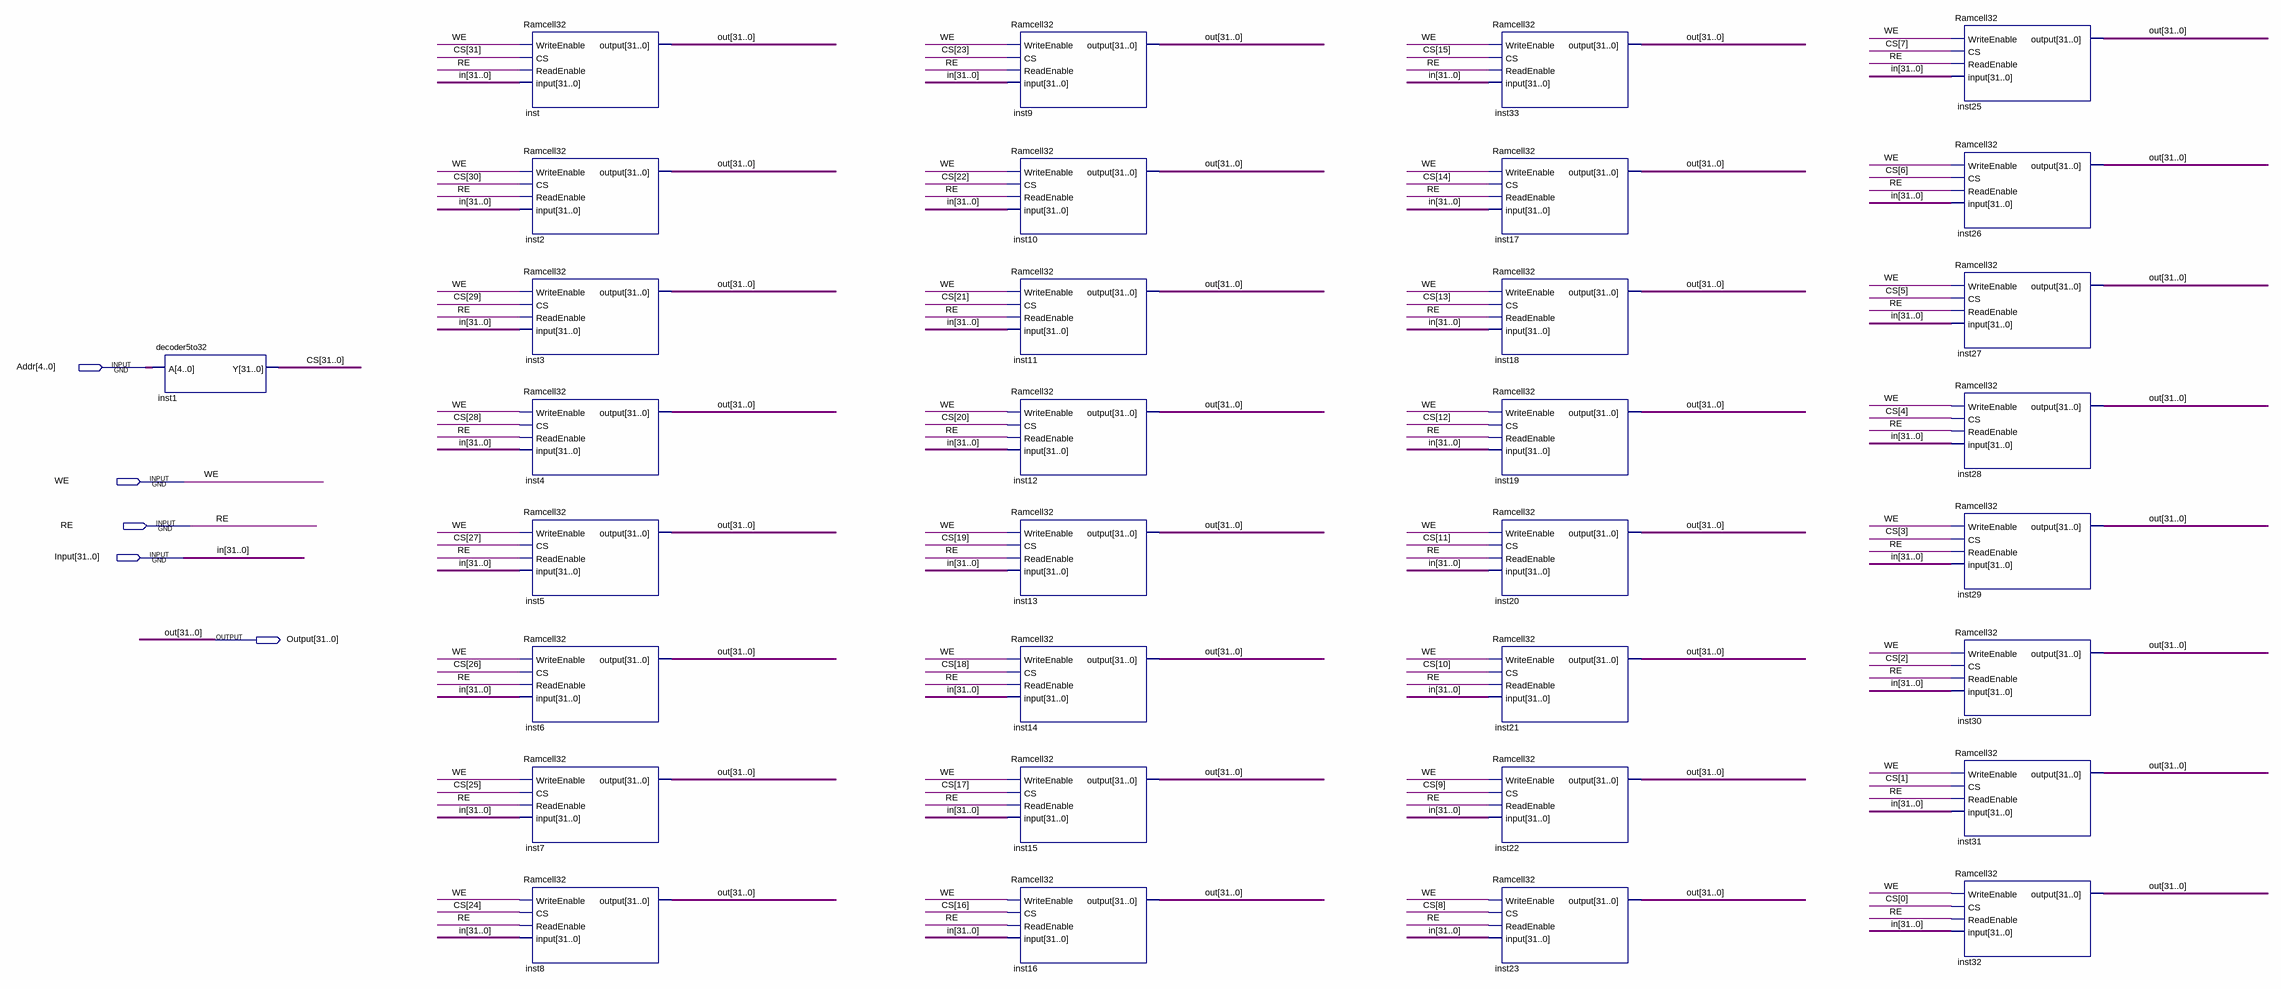
[diagram p0: schematic sheet]
// Quartus schematic Dmem32.bdf as structural Verilog: 33 symbols, 5 pins
module Dmem32 (
  input  [4:0] Addr,
  input  WE,
  input  RE,
  input  [31:0] Input,
  output [31:0] Output
);

  wire [31:0] CS;

  decoder5to32 inst1 (.A(Addr), .Y(CS));
  Ramcell32 inst (.WriteEnable(WE), .CS(CS[31]), .ReadEnable(RE), .\input (Input), .\output (Output));
  Ramcell32 inst2 (.WriteEnable(WE), .CS(CS[30]), .ReadEnable(RE), .\input (Input), .\output (Output));
  Ramcell32 inst3 (.WriteEnable(WE), .CS(CS[29]), .ReadEnable(RE), .\input (Input), .\output (Output));
  Ramcell32 inst4 (.WriteEnable(WE), .CS(CS[28]), .ReadEnable(RE), .\input (Input), .\output (Output));
  Ramcell32 inst5 (.WriteEnable(WE), .CS(CS[27]), .ReadEnable(RE), .\input (Input), .\output (Output));
  Ramcell32 inst6 (.WriteEnable(WE), .CS(CS[26]), .ReadEnable(RE), .\input (Input), .\output (Output));
  Ramcell32 inst7 (.WriteEnable(WE), .CS(CS[25]), .ReadEnable(RE), .\input (Input), .\output (Output));
  Ramcell32 inst8 (.WriteEnable(WE), .CS(CS[24]), .ReadEnable(RE), .\input (Input), .\output (Output));
  Ramcell32 inst9 (.WriteEnable(WE), .CS(CS[23]), .ReadEnable(RE), .\input (Input), .\output (Output));
  Ramcell32 inst10 (.WriteEnable(WE), .CS(CS[22]), .ReadEnable(RE), .\input (Input), .\output (Output));
  Ramcell32 inst11 (.WriteEnable(WE), .CS(CS[21]), .ReadEnable(RE), .\input (Input), .\output (Output));
  Ramcell32 inst12 (.WriteEnable(WE), .CS(CS[20]), .ReadEnable(RE), .\input (Input), .\output (Output));
  Ramcell32 inst13 (.WriteEnable(WE), .CS(CS[19]), .ReadEnable(RE), .\input (Input), .\output (Output));
  Ramcell32 inst14 (.WriteEnable(WE), .CS(CS[18]), .ReadEnable(RE), .\input (Input), .\output (Output));
  Ramcell32 inst15 (.WriteEnable(WE), .CS(CS[17]), .ReadEnable(RE), .\input (Input), .\output (Output));
  Ramcell32 inst16 (.WriteEnable(WE), .CS(CS[16]), .ReadEnable(RE), .\input (Input), .\output (Output));
  Ramcell32 inst33 (.WriteEnable(WE), .CS(CS[15]), .ReadEnable(RE), .\input (Input), .\output (Output));
  Ramcell32 inst17 (.WriteEnable(WE), .CS(CS[14]), .ReadEnable(RE), .\input (Input), .\output (Output));
  Ramcell32 inst18 (.WriteEnable(WE), .CS(CS[13]), .ReadEnable(RE), .\input (Input), .\output (Output));
  Ramcell32 inst19 (.WriteEnable(WE), .CS(CS[12]), .ReadEnable(RE), .\input (Input), .\output (Output));
  Ramcell32 inst20 (.WriteEnable(WE), .CS(CS[11]), .ReadEnable(RE), .\input (Input), .\output (Output));
  Ramcell32 inst21 (.WriteEnable(WE), .CS(CS[10]), .ReadEnable(RE), .\input (Input), .\output (Output));
  Ramcell32 inst22 (.WriteEnable(WE), .CS(CS[9]), .ReadEnable(RE), .\input (Input), .\output (Output));
  Ramcell32 inst23 (.WriteEnable(WE), .CS(CS[8]), .ReadEnable(RE), .\input (Input), .\output (Output));
  Ramcell32 inst25 (.WriteEnable(WE), .CS(CS[7]), .ReadEnable(RE), .\input (Input), .\output (Output));
  Ramcell32 inst26 (.WriteEnable(WE), .CS(CS[6]), .ReadEnable(RE), .\input (Input), .\output (Output));
  Ramcell32 inst27 (.WriteEnable(WE), .CS(CS[5]), .ReadEnable(RE), .\input (Input), .\output (Output));
  Ramcell32 inst28 (.WriteEnable(WE), .CS(CS[4]), .ReadEnable(RE), .\input (Input), .\output (Output));
  Ramcell32 inst29 (.WriteEnable(WE), .CS(CS[3]), .ReadEnable(RE), .\input (Input), .\output (Output));
  Ramcell32 inst30 (.WriteEnable(WE), .CS(CS[2]), .ReadEnable(RE), .\input (Input), .\output (Output));
  Ramcell32 inst31 (.WriteEnable(WE), .CS(CS[1]), .ReadEnable(RE), .\input (Input), .\output (Output));
  Ramcell32 inst32 (.WriteEnable(WE), .CS(CS[0]), .ReadEnable(RE), .\input (Input), .\output (Output));

  // Other names for the same wires on the sheet: in[31:0] = Input; out[31:0] = Output
endmodule
